# Altium project Anahata_Control_PCB.PrjPcb
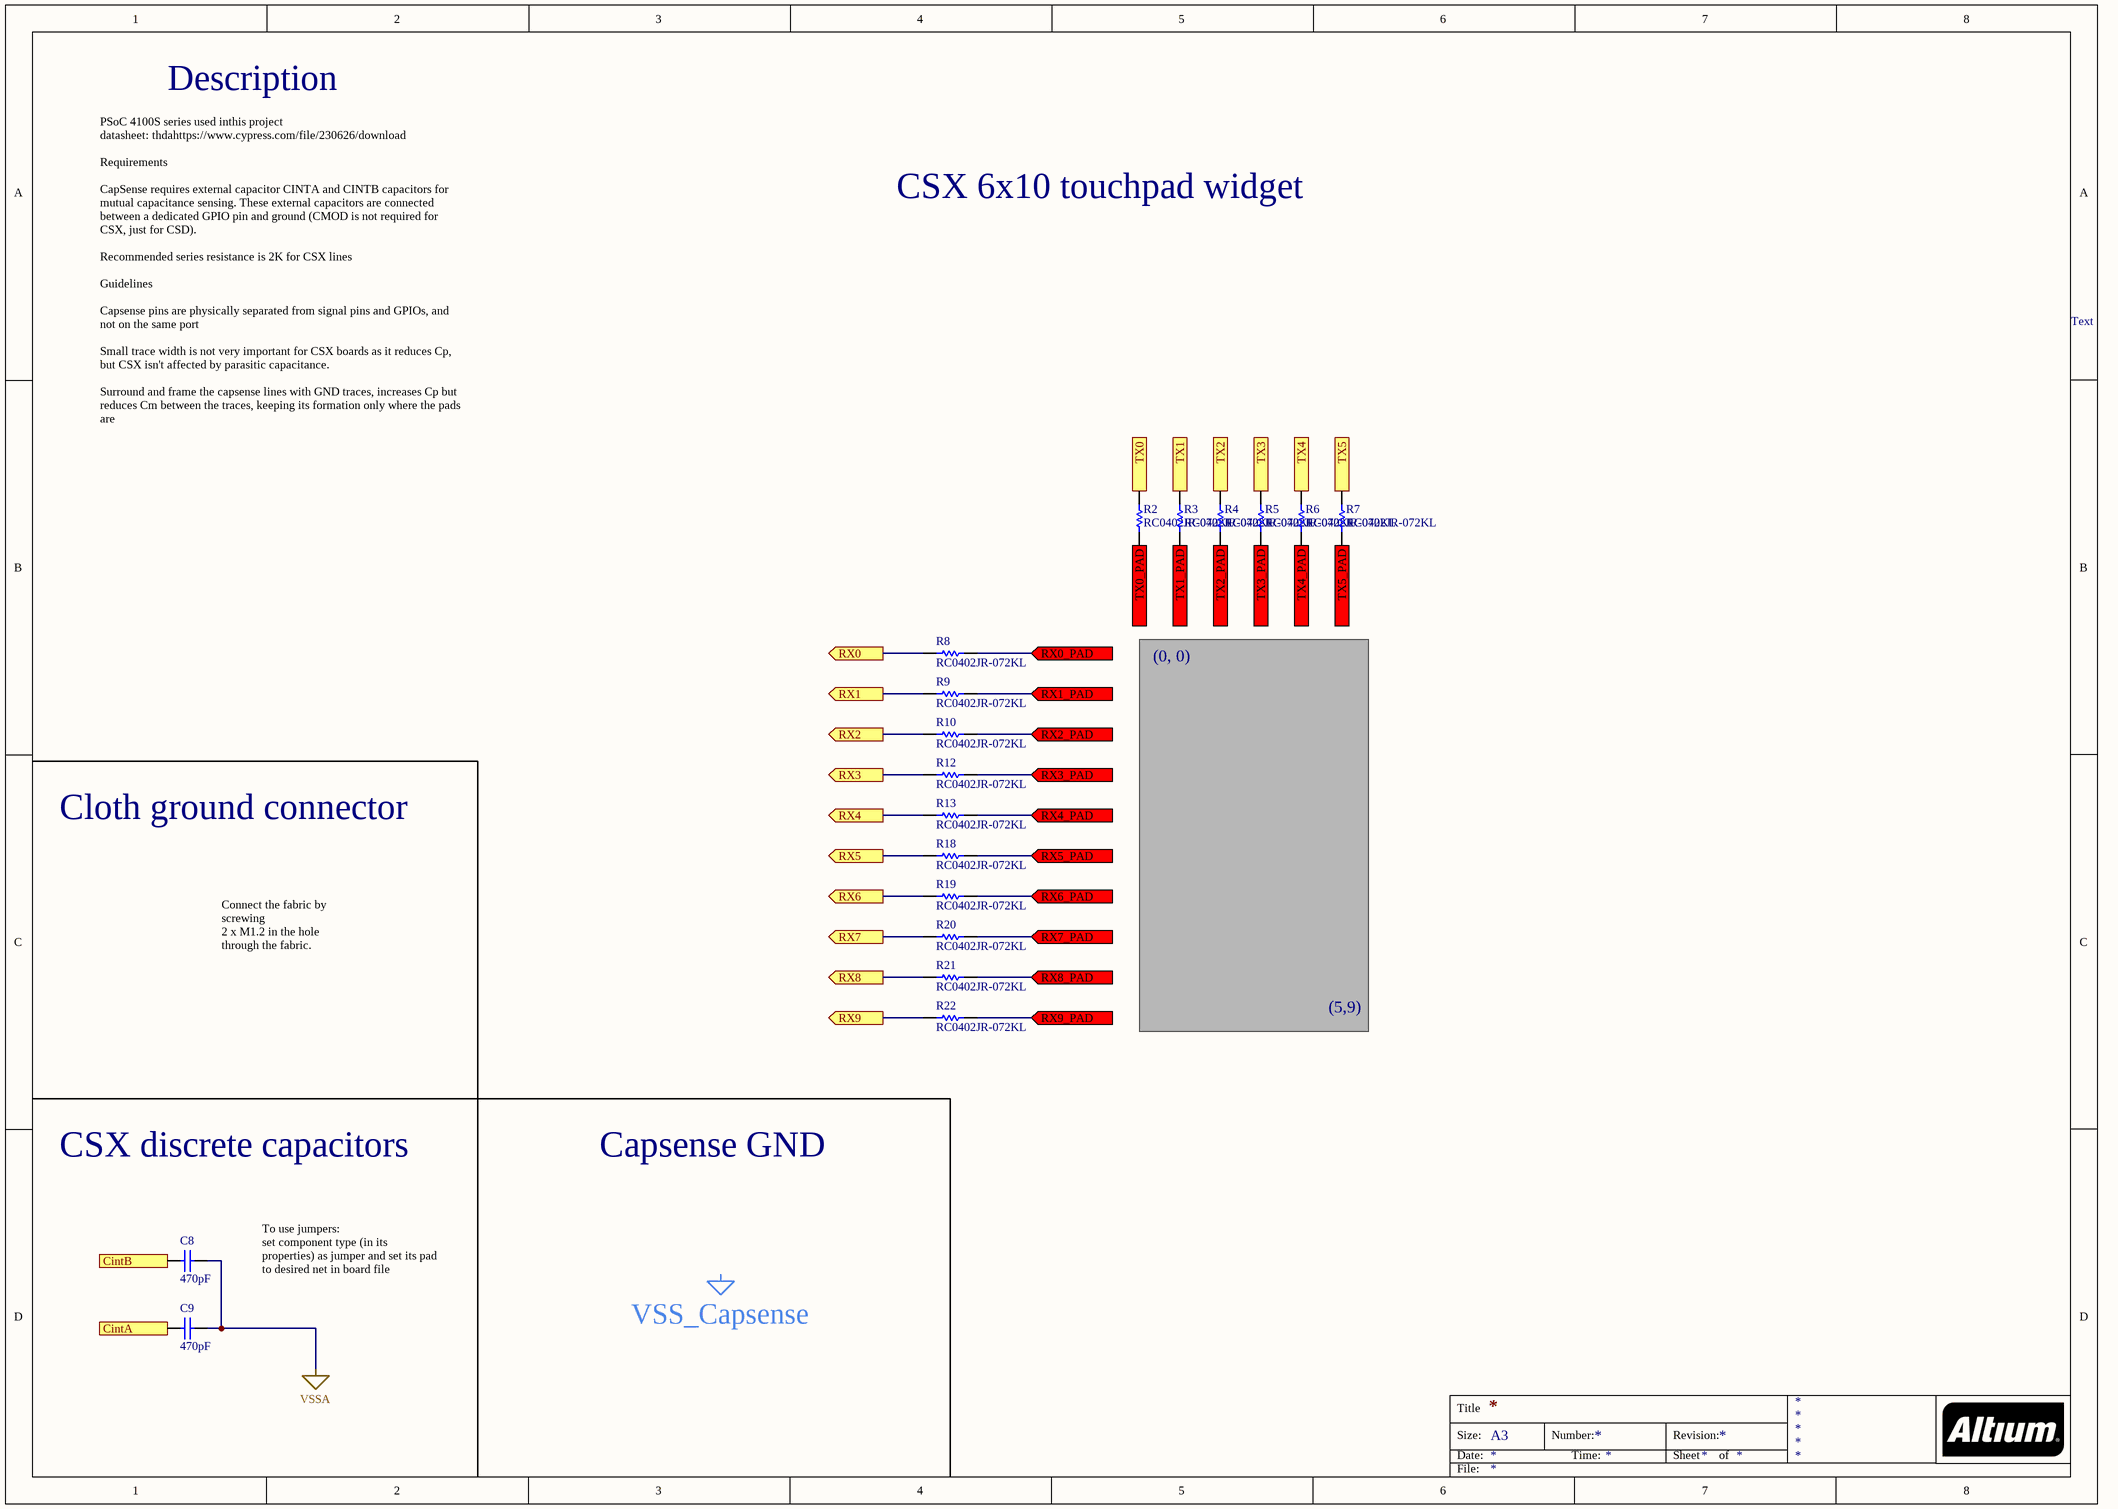
[diagram p0: CSX_Capsense.SchDoc]
1 sheet, 18 parts. Net scope: flat (ports and power ports of the same name join across sheets).
Board file: Muladhara_Circuit.PcbDoc

## Sheet CSX_Capsense.SchDoc
size A3

### Parts
C8  470pF  [CAPC0603(1608)100_N]
C9  470pF  [CAPC0603(1608)100_N]
R2  RC0402JR-072KL  [RESC1005X40X25ML05T10]
R3  RC0402JR-072KL  [RESC1005X40X25ML05T10]
R4  RC0402JR-072KL  [RESC1005X40X25ML05T10]
R5  RC0402JR-072KL  [RESC1005X40X25ML05T10]
R6  RC0402JR-072KL  [RESC1005X40X25ML05T10]
R7  RC0402JR-072KL  [RESC1005X40X25ML05T10]
R8  RC0402JR-072KL  [RESC1005X40X25ML05T10]
R9  RC0402JR-072KL  [RESC1005X40X25ML05T10]
R10  RC0402JR-072KL  [RESC1005X40X25ML05T10]
R12  RC0402JR-072KL  [RESC1005X40X25ML05T10]
R13  RC0402JR-072KL  [RESC1005X40X25ML05T10]
R18  RC0402JR-072KL  [RESC1005X40X25ML05T10]
R19  RC0402JR-072KL  [RESC1005X40X25ML05T10]
R20  RC0402JR-072KL  [RESC1005X40X25ML05T10]
R21  RC0402JR-072KL  [RESC1005X40X25ML05T10]
R22  RC0402JR-072KL  [RESC1005X40X25ML05T10]

### Ports
CintA, CintB, RX0 (out), RX0_PAD (in), RX1 (out), RX1_PAD (in), RX2 (out), RX2_PAD (in), RX3 (out), RX3_PAD (in), RX4 (out), RX4_PAD (in), RX5 (out), RX5_PAD (in), RX6 (out), RX6_PAD (in), RX7 (out), RX7_PAD (in), RX8 (out), RX8_PAD (in), RX9 (out), RX9_PAD (in), TX0 (in), TX0_PAD (out), TX1 (in), TX1_PAD (out), TX2 (in), TX2_PAD (out), TX3 (in), TX3_PAD (out), TX4 (in), TX4_PAD (out), TX5 (in), TX5_PAD (out)

### Nets
VSSA: C8.2 C9.2
CintA: C9.1 ; port CintA
CintB: C8.1 ; port CintB
RX0: R8.1 ; port RX0
RX0_PAD: R8.2 ; port RX0_PAD
RX1: R9.1 ; port RX1
RX1_PAD: R9.2 ; port RX1_PAD
RX2: R10.1 ; port RX2
RX2_PAD: R10.2 ; port RX2_PAD
RX3: R12.1 ; port RX3
RX3_PAD: R12.2 ; port RX3_PAD
RX4: R13.1 ; port RX4
RX4_PAD: R13.2 ; port RX4_PAD
RX5: R18.1 ; port RX5
RX5_PAD: R18.2 ; port RX5_PAD
RX6: R19.1 ; port RX6
RX6_PAD: R19.2 ; port RX6_PAD
RX7: R20.1 ; port RX7
RX7_PAD: R20.2 ; port RX7_PAD
RX8: R21.1 ; port RX8
RX8_PAD: R21.2 ; port RX8_PAD
RX9: R22.1 ; port RX9
RX9_PAD: R22.2 ; port RX9_PAD
TX0: R2.2 ; port TX0
TX0_PAD: R2.1 ; port TX0_PAD
TX1: R3.2 ; port TX1
TX1_PAD: R3.1 ; port TX1_PAD
TX2: R4.2 ; port TX2
TX2_PAD: R4.1 ; port TX2_PAD
TX3: R5.2 ; port TX3
TX3_PAD: R5.1 ; port TX3_PAD
TX4: R6.2 ; port TX4
TX4_PAD: R6.1 ; port TX4_PAD
TX5: R7.2 ; port TX5
TX5_PAD: R7.1 ; port TX5_PAD

### Notes on the sheet
- Description
- CSX 6x10 touchpad widget
- Text
- PSoC 4100S series used inthis project
  datasheet: thdahttps://www.cypress.com/file/230626/download
  Requirements
  CapSense requires external capacitor CINTA and CINTB capacitors for mutual capacitance sensing. These external capacitors are connected between a dedicated GPIO pin and ground (CMOD is not required for CSX, just for CSD).
  Recommended series resistance is 2K for CSX lines
  Guidelines
  Capsense pins are physically separated from signal pins and GPIOs, and not on the same port
  Small trace width is not very important for CSX boards as it reduces Cp, but CSX isn't affected by parasitic capacitance.
  Surround and frame the capsense lines with GND traces, increases Cp but reduces Cm between the traces, keeping its formation only where the pads are
- (0, 0)
- Cloth ground connector
- Connect the fabric by screwing
  2 x M1.2 in the hole through the fabric.
- (5,9)
- CSX discrete capacitors
- Capsense GND
- To use jumpers:
  set component type (in its properties) as jumper and set its pad to desired net in board file
- Labels drawn without touching a wire or pin: VSS_Capsense
- Title
- Size:
- Date:
- A3
- Number:
- Time:
- Revision:
- Sheet
- of
- File:

### Library data of the parts
C8 C9 = CMP-1035-01661-1: CAP 470pF 10V ±10% 0603 (1608 Metric) Thickness 1mm SMD; Case-EIA: 0603; Tolerance: Â±10%; Case-Metric: 1608; Max Thickness: 1 mm; Rated Voltage: 10 V; Technology: SMT; Value: 470pF
R2-R10 R12 R13 R18-R22 = CMP-2002-07972-1: Manufacturer: Yageo / Phycomp; Part Number: RC0402JR-072KL